# Altium project 题目一考核.PrjPcb
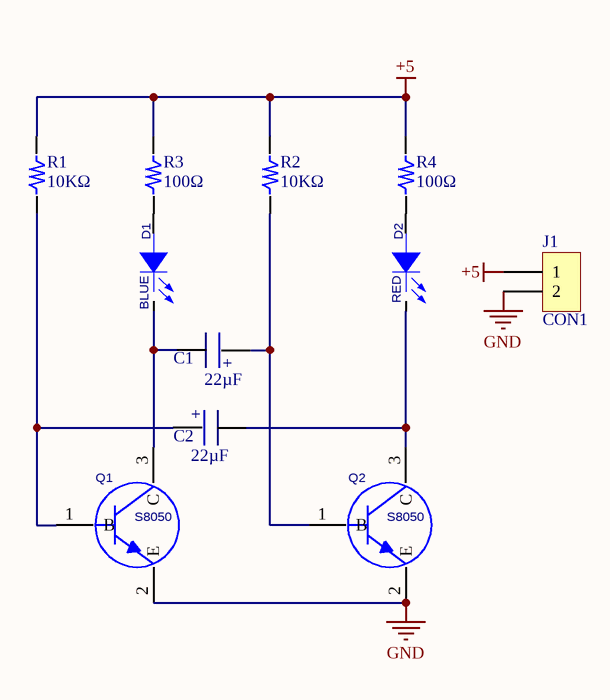
[diagram p0: 题目一原理图.SchDoc]
1 sheet, 11 parts. Net scope: global (net labels, ports and power ports of the same name join across sheets).
Board file: 题目一PCB.PcbDoc

## Sheet 题目一原理图.SchDoc
size A4; SheetNumber: 1; SheetTotal: 1

### Parts
C1  22µF  [CAP_1]
C2  22µF  [CAP_1]
D1  value BLUE  [LED_5MM]  (hidden comment: LED)
D2  value RED  [LED_5MM]  (hidden comment: LED)
J1  CON1  [sip-2]
Q1  S8050  [TO-92]
Q2  S8050  [TO-92]
R1  10KΩ  [AXIAL0.4]
R2  10KΩ  [AXIAL0.4]
R3  100Ω  [AXIAL0.4]
R4  100Ω  [AXIAL0.4]

### Nets
+5: J1.1 R1.2 R2.2 R3.2 R4.2
GND: J1.2 Q1.2(E) Q2.2(E)
NetC1_1: C1.1 Q2.1(B) R2.1
NetC1_2: C1.2 D1.2(CATHODE) Q1.3(C)
NetC2_1: C2.1 Q1.1(B) R1.1
NetC2_2: C2.2 D2.2(CATHODE) Q2.3(C)
NetD1_1: D1.1(ANODE) R3.1
NetD2_1: D2.1(ANODE) R4.1

### Notes on the sheet
- (in symbol CAP+) +

### Library data of the parts
C1 C2 = CAP+
D1 D2 = LED: PCB DECAL: LED_0603
J1 = CON2: Connector
Q1 Q2 = S8050: NPN; PCB DECAL: SOT-23; Manufacturer #2: 8050
R1-R4 = RES